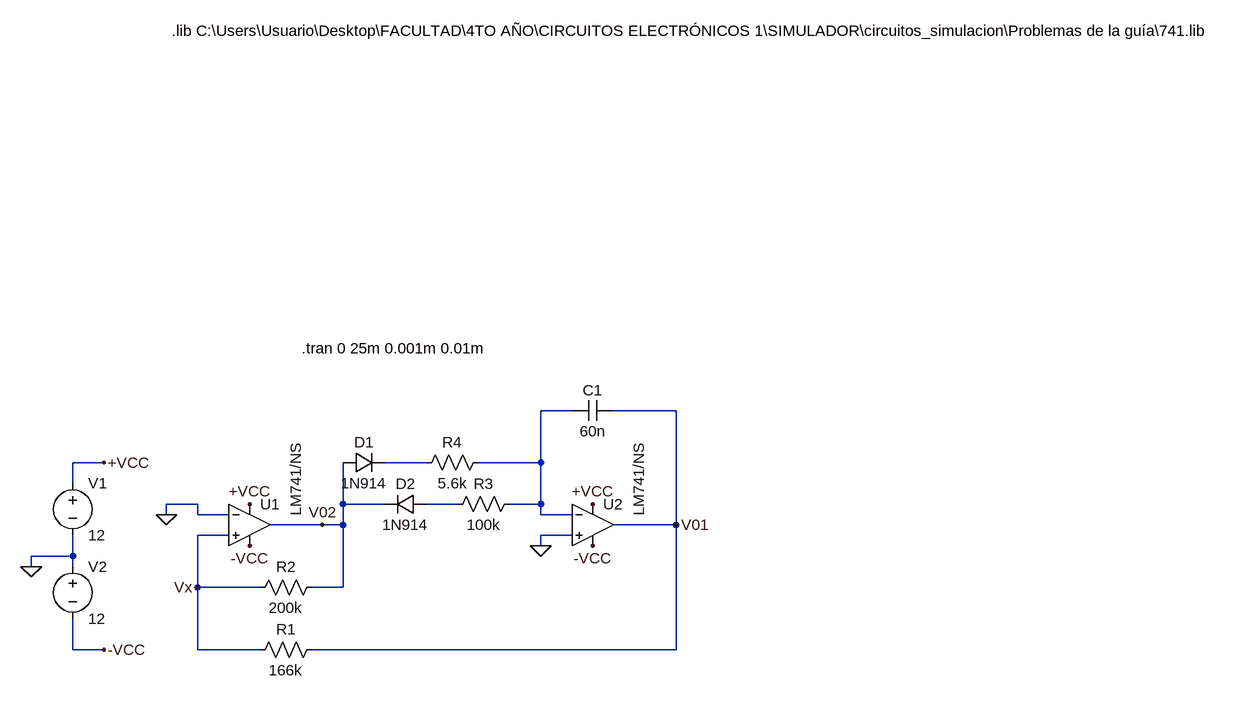
[diagram p0: schematic Draft1.asc]
Draft1.asc, the LTspice schematic file:
Version 4
SHEET 1 1636 680
WIRE 528 176 480 176
WIRE 688 176 592 176
WIRE -192 256 -240 256
WIRE 304 256 240 256
WIRE 480 256 480 176
WIRE 480 256 384 256
WIRE -240 288 -240 256
WIRE -48 320 -96 320
WIRE 176 320 176 256
WIRE 240 320 176 320
WIRE 352 320 304 320
WIRE 480 320 480 256
WIRE 480 320 432 320
WIRE -96 336 -96 320
WIRE -48 336 -48 320
WIRE 0 336 -48 336
WIRE 480 336 480 320
WIRE 528 336 480 336
WIRE 144 352 64 352
WIRE 176 352 176 320
WIRE 176 352 144 352
WIRE 688 352 688 176
WIRE 688 352 592 352
WIRE 0 368 -48 368
WIRE 528 368 480 368
WIRE 480 384 480 368
WIRE -240 400 -240 368
WIRE -240 400 -304 400
WIRE -304 416 -304 400
WIRE -240 416 -240 400
WIRE -48 448 -48 368
WIRE 48 448 -48 448
WIRE 176 448 176 352
WIRE 176 448 128 448
WIRE -240 544 -240 496
WIRE -192 544 -240 544
WIRE -48 544 -48 448
WIRE 48 544 -48 544
WIRE 688 544 688 352
WIRE 688 544 128 544
FLAG 32 384 -VCC
FLAG 32 320 +VCC
FLAG 560 384 -VCC
FLAG 560 320 +VCC
FLAG -304 416 0
FLAG -192 544 -VCC
FLAG -192 256 +VCC
FLAG -96 336 0
FLAG 480 384 0
FLAG 688 352 V01
FLAG 144 352 V02
FLAG -48 448 Vx
SYMBOL OpAmps\\opamp2 32 288 R0
WINDOW 3 71 50 VLeft 2
SYMATTR Value LM741/NS
SYMATTR InstName U1
SYMBOL OpAmps\\opamp2 560 288 R0
WINDOW 3 71 50 VLeft 2
SYMATTR Value LM741/NS
SYMATTR InstName U2
SYMBOL voltage -240 272 R0
WINDOW 123 0 0 Left 0
WINDOW 39 0 0 Left 0
SYMATTR InstName V1
SYMATTR Value 12
SYMBOL voltage -240 400 R0
WINDOW 123 0 0 Left 0
WINDOW 39 0 0 Left 0
SYMATTR InstName V2
SYMATTR Value 12
SYMBOL diode 176 240 M90
WINDOW 0 0 32 VBottom 2
WINDOW 3 32 32 VTop 2
SYMATTR InstName D1
SYMATTR Value 1N914
SYMBOL diode 304 336 M270
WINDOW 0 32 32 VTop 2
WINDOW 3 0 32 VBottom 2
SYMATTR InstName D2
SYMATTR Value 1N914
SYMBOL res 144 528 R90
WINDOW 0 0 56 VBottom 2
WINDOW 3 32 56 VTop 2
SYMATTR InstName R1
SYMATTR Value 166k
SYMBOL res 144 432 R90
WINDOW 0 0 56 VBottom 2
WINDOW 3 32 56 VTop 2
SYMATTR InstName R2
SYMATTR Value 200k
SYMBOL res 448 304 R90
WINDOW 0 0 56 VBottom 2
WINDOW 3 32 56 VTop 2
SYMATTR InstName R3
SYMATTR Value 100k
SYMBOL res 400 240 R90
WINDOW 0 0 56 VBottom 2
WINDOW 3 32 56 VTop 2
SYMATTR InstName R4
SYMATTR Value 5.6k
SYMBOL cap 592 160 R90
WINDOW 0 0 32 VBottom 2
WINDOW 3 32 32 VTop 2
SYMATTR InstName C1
SYMATTR Value 60n
TEXT -88 -408 Left 2 !.lib C:\\Users\\Usuario\\Desktop\\FACULTAD\\4TO AÑO\\CIRCUITOS ELECTRÓNICOS 1\\SIMULADOR\\circuitos_simulacion\\Problemas de la guía\\741.lib
TEXT 112 80 Left 2 !.tran 0 25m 0.001m 0.01m

The netlist it stands for:
* Draft1.asc
XU1 Vx 0 +VCC -VCC V02 LM741/NS  ; pins In+ In- V+ V- OUT
XU2 0 N001 +VCC -VCC V01 LM741/NS  ; pins In+ In- V+ V- OUT
V1 +VCC 0 12
V2 0 -VCC 12
D1 V02 N002 1N914
D2 N003 V02 1N914
R1 V01 Vx 166k
R2 V02 Vx 200k
R3 N001 N003 100k
R4 N001 N002 5.6k
C1 V01 N001 60n
.model D D
.lib standard.dio
.lib C:\Users\Usuario\Desktop\FACULTAD\4TO AÑO\CIRCUITOS ELECTRÓNICOS 1\SIMULADOR\circuitos_simulacion\Problemas de la guía\741.lib
.tran 0 25m 0.001m 0.01m
.backanno
.end